# EAGLE design Mega (EAGLE 7.5.0)
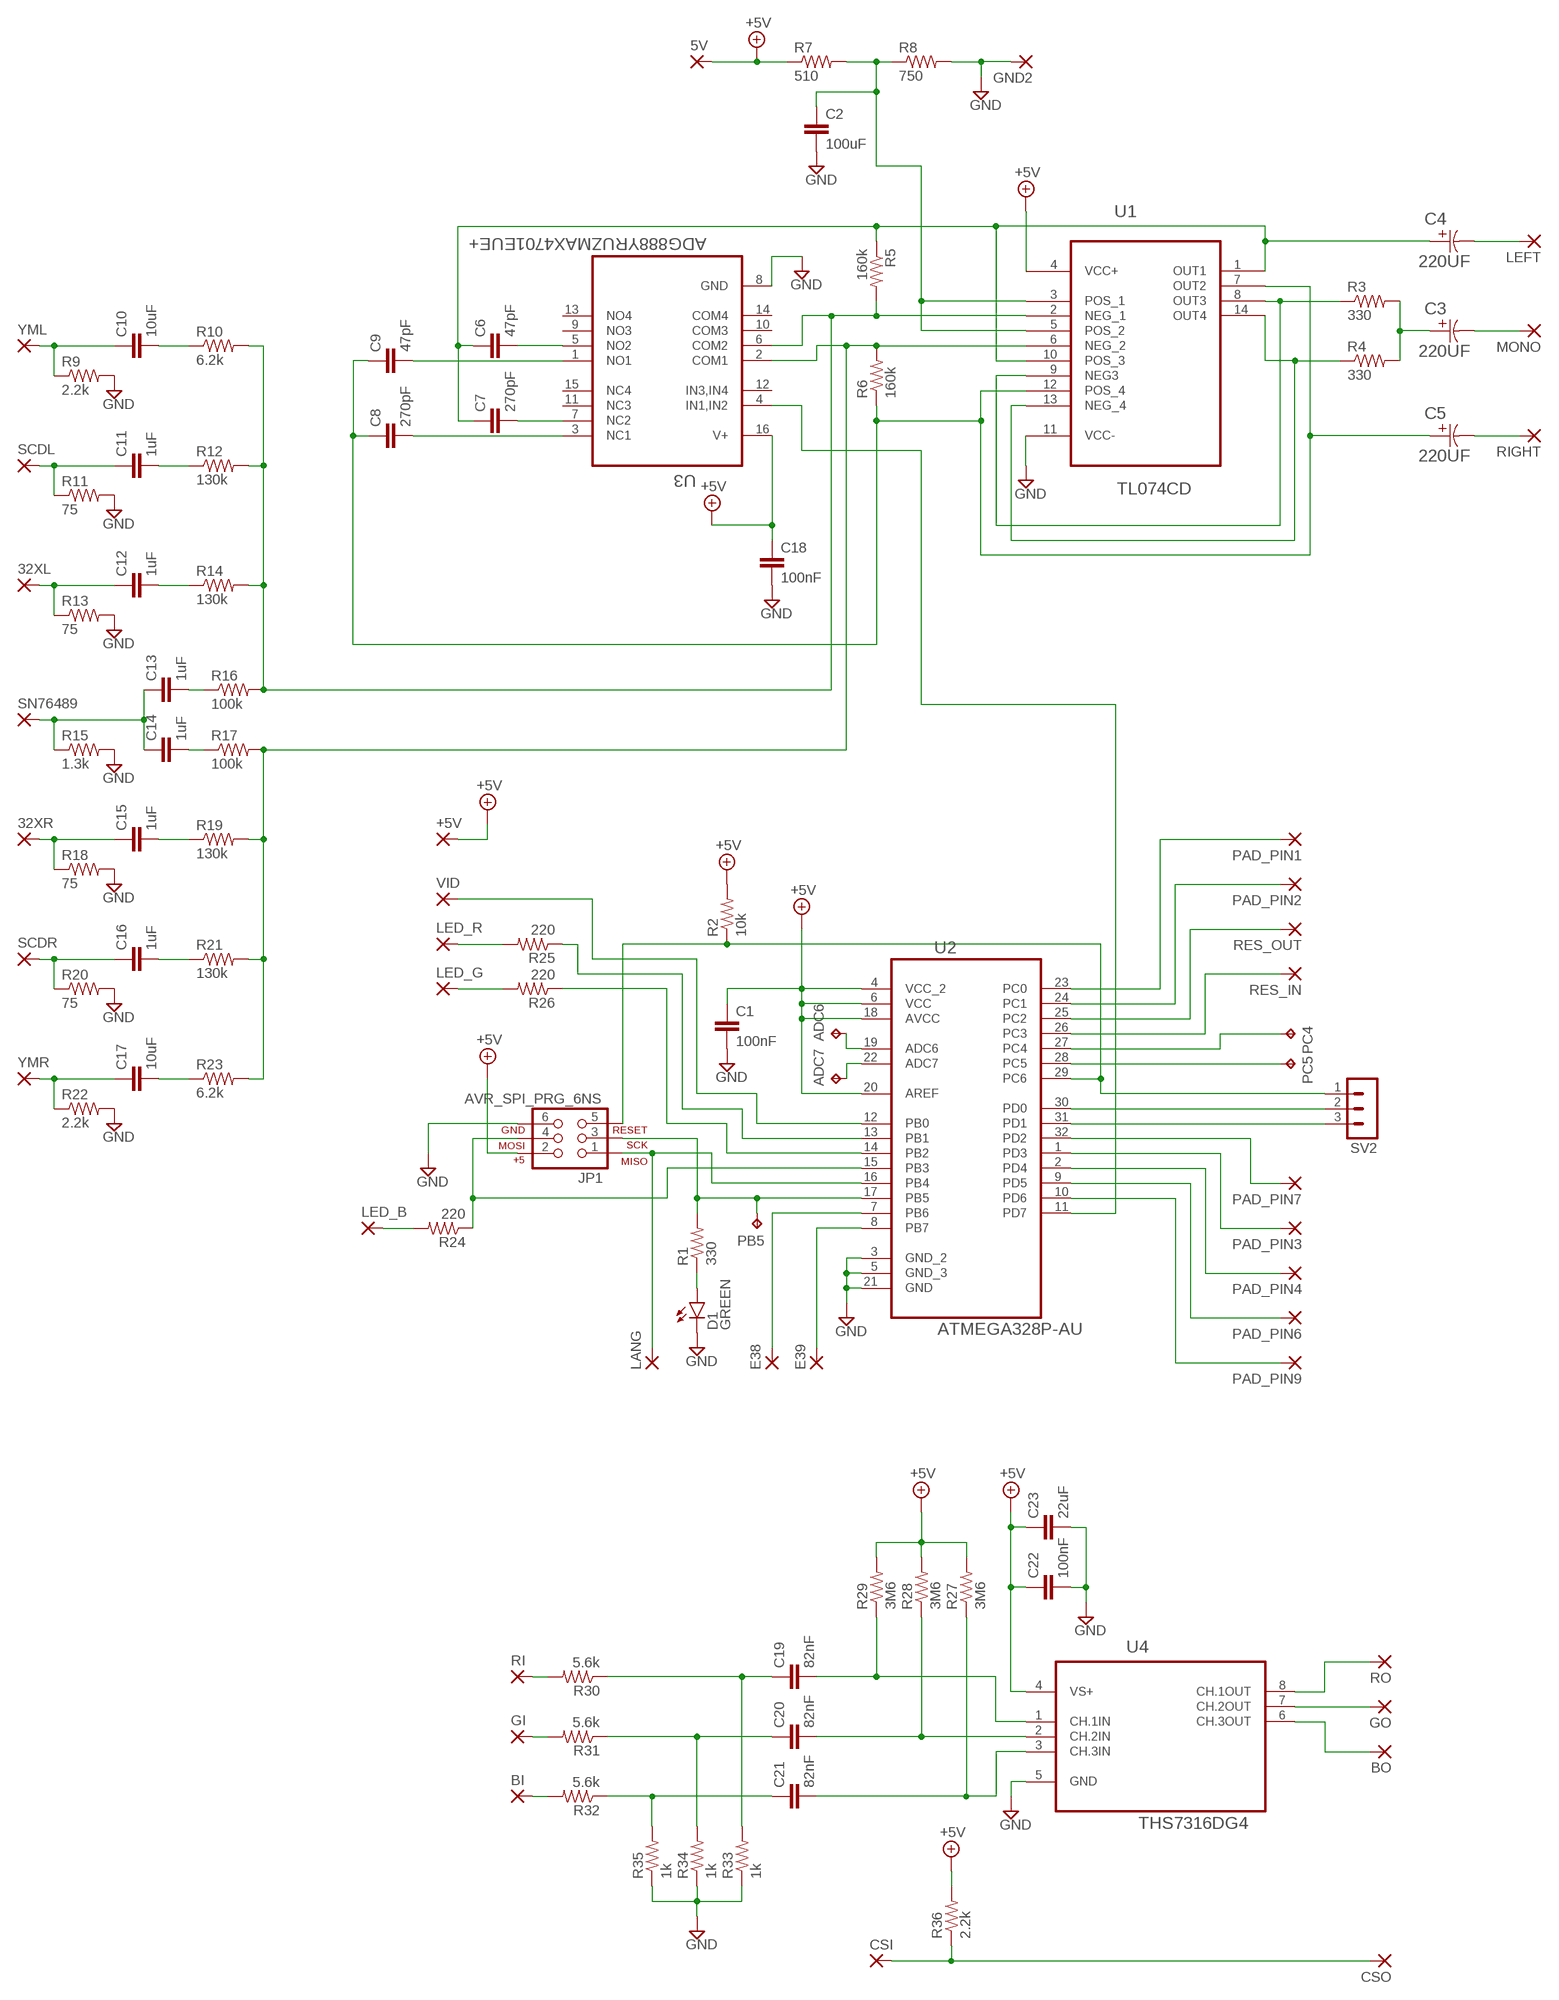
[diagram p0: schematic, sheet 1]

## Parts
5V  SMD2  [SMD1,27-2,54]
32XL  SMD2  [SMD1,27-2,54]
32XR  SMD2  [SMD1,27-2,54]
+5V  SMD2  [SMD1,27-2,54]
ADC6  TPB1,27  [B1,27]
ADC7  TPB1,27  [B1,27]
BI  SMD2  [SMD1,27-2,54]
BO  SMD2  [SMD1,27-2,54]
C1  100nF  CAP0805  [0805]
C2  100uF  CAP1206  [1206]
C3  220UF  EEE-FK1C221P-CASE-E  [CAPAE830X650N]
C4  220UF  EEE-FK1C221P-CASE-E  [CAPAE830X650N]
C5  220UF  EEE-FK1C221P-CASE-E  [CAPAE830X650N]
C6  47pF  CAP0805  [0805]
C7  270pF  CAP0805  [0805]
C8  270pF  CAP0805  [0805]
C9  47pF  CAP0805  [0805]
C10  10uF  CAP0805  [0805]
C11  1uF  CAP0805  [0805]
C12  1uF  CAP0805  [0805]
C13  1uF  CAP0805  [0805]
C14  1uF  CAP0805  [0805]
C15  1uF  CAP0805  [0805]
C16  1uF  CAP0805  [0805]
C17  10uF  CAP0805  [0805]
C18  100nF  CAP0805  [0805]
C19  82nF  CAP0805  [0805]
C20  82nF  CAP0805  [0805]
C21  82nF  CAP0805  [0805]
C22  100nF  CAP0805  [0805]
C23  22uF  CAP0805  [0805]
CSI  SMD2  [SMD1,27-2,54]
CSO  SMD2  [SMD1,27-2,54]
D1  GREEN  LED1206  [LED-1206]
E38  SMD2  [SMD1,27-2,54]
E39  SMD2  [SMD1,27-2,54]
GI  SMD2  [SMD1,27-2,54]
GND2  SMD2  [SMD1,27-2,54]
GO  SMD2  [SMD1,27-2,54]
JP1  AVR_SPI_PRG_6NS  [2X3-NS]
LANG  SMD2  [SMD1,27-2,54]
LED_B  SMD2  [SMD1,27-2,54]
LED_G  SMD2  [SMD1,27-2,54]
LED_R  SMD2  [SMD1,27-2,54]
LEFT  SMD2  [SMD1,27-2,54]
MONO  SMD2  [SMD1,27-2,54]
PAD_PIN1  SMD2  [SMD1,27-2,54]
PAD_PIN2  SMD2  [SMD1,27-2,54]
PAD_PIN3  SMD2  [SMD1,27-2,54]
PAD_PIN4  SMD2  [SMD1,27-2,54]
PAD_PIN6  SMD2  [SMD1,27-2,54]
PAD_PIN7  SMD2  [SMD1,27-2,54]
PAD_PIN9  SMD2  [SMD1,27-2,54]
PB5  TPB1,27  [B1,27]
PC4  TPB1,27  [B1,27]
PC5  TPB1,27  [B1,27]
R1  330  RESISTOR0805-RES  [0805]
R2  10k  RESISTOR0805-RES  [0805]
R3  330  RESISTOR0805-RES  [0805]
R4  330  RESISTOR0805-RES  [0805]
R5  160k  RESISTOR0805-RES  [0805]
R6  160k  RESISTOR0805-RES  [0805]
R7  510  RESISTOR0805-RES  [0805]
R8  750  RESISTOR0805-RES  [0805]
R9  2.2k  RESISTOR0805-RES  [0805]
R10  6.2k  RESISTOR0805-RES  [0805]
R11  75  RESISTOR0805-RES  [0805]
R12  130k  RESISTOR0805-RES  [0805]
R13  75  RESISTOR0805-RES  [0805]
R14  130k  RESISTOR0805-RES  [0805]
R15  1.3k  RESISTOR0805-RES  [0805]
R16  100k  RESISTOR0805-RES  [0805]
R17  100k  RESISTOR0805-RES  [0805]
R18  75  RESISTOR0805-RES  [0805]
R19  130k  RESISTOR0805-RES  [0805]
R20  75  RESISTOR0805-RES  [0805]
R21  130k  RESISTOR0805-RES  [0805]
R22  2.2k  RESISTOR0805-RES  [0805]
R23  6.2k  RESISTOR0805-RES  [0805]
R24  220  RESISTOR0805-RES  [0805]
R25  220  RESISTOR0805-RES  [0805]
R26  220  RESISTOR0805-RES  [0805]
R27  3M6  RESISTOR0805-RES  [0805]
R28  3M6  RESISTOR0805-RES  [0805]
R29  3M6  RESISTOR0805-RES  [0805]
R30  5.6k  RESISTOR0805-RES  [0805]
R31  5.6k  RESISTOR0805-RES  [0805]
R32  5.6k  RESISTOR0805-RES  [0805]
R33  1k  RESISTOR0805-RES  [0805]
R34  1k  RESISTOR0805-RES  [0805]
R35  1k  RESISTOR0805-RES  [0805]
R36  2.2k  RESISTOR0805-RES  [0805]
RES_IN  SMD2  [SMD1,27-2,54]
RES_OUT  SMD2  [SMD1,27-2,54]
RI  SMD2  [SMD1,27-2,54]
RIGHT  SMD2  [SMD1,27-2,54]
RO  SMD2  [SMD1,27-2,54]
SCDL  SMD2  [SMD1,27-2,54]
SCDR  SMD2  [SMD1,27-2,54]
SN76489  SMD2  [SMD1,27-2,54]
SV2  MA03-1  [MA03-1]
U1  TL074CD  [SOIC127P600X175-14N]
U2  ATMEGA328P-AU  [QFP80P900X900X120-32N]
U3  ADG888YRUZMAX4701EUE+  [SOP65P640X120-16N]
U4  THS7316DG4  [SOIC127P600X175-8N]
VID  SMD2  [SMD1,27-2,54]
YML  SMD2  [SMD1,27-2,54]
YMR  SMD2  [SMD1,27-2,54]

## Nets
+5V: 5V.1(P) +5V.1(P) C1.1 C18.1 C22.1 C23.1 JP1.2 R2.2 R7.1 R27.2 R28.2 R29.2 R36.2 U1.4(VCC+) U2.4(VCC_2) U2.6(VCC) U2.18(AVCC) U2.20(AREF) U3.16(V+) U4.4(VS+)
GND: C1.2 C2.2 C18.2 C22.2 C23.2 D1.C GND2.1(P) JP1.6 R8.2 R9.2 R11.2 R13.2 R15.2 R18.2 R20.2 R22.2 R33.1 R34.1 R35.1 U1.11(VCC-) U2.3(GND_2) U2.5(GND_3) U2.21(GND) U3.8(GND) U4.5(GND)
N$1: D1.A R1.1
N$2: JP1.3 PB5.TP R1.2 U2.17(PB5)
N$3: JP1.5 R2.1 SV2.1 U2.29(PC6)
N$4: JP1.1 LANG.1(P) U2.16(PB4)
N$5: JP1.4 R24.1 U2.15(PB3)
N$6: LED_R.1(P) R25.2
N$7: LED_G.1(P) R26.2
N$8: R3.1 U1.8(OUT3) U1.9(NEG3)
N$9: PC4.TP U2.27(PC4)
N$10: PC5.TP U2.28(PC5)
N$11: R4.1 U1.13(NEG_4) U1.14(OUT4)
N$12: C3.1 R3.2 R4.2
N$13: C3.2 MONO.1(P)
N$14: C4.2 LEFT.1(P)
N$15: RES_IN.1(P) U2.26(PC3)
N$16: C4.1 C6.1 C7.1 R5.1 U1.1(OUT1) U1.10(POS_3)
N$17: C5.1 C8.1 C9.1 R6.1 U1.7(OUT2) U1.12(POS_4)
N$18: C5.2 RIGHT.1(P)
N$19: R6.2 R17.2 R19.2 R21.2 R23.2 U1.6(NEG_2) U3.2(COM1)
N$20: C6.2 U3.5(NO2)
N$21: C8.2 U3.3(NC1)
N$22: C7.2 U3.7(NC2)
N$23: C9.2 U3.1(NO1)
N$24: C10.1 R9.1 YML.1(P)
N$25: C2.1 R7.2 R8.1 U1.3(POS_1) U1.5(POS_2)
N$26: C10.2 R10.1
N$27: C11.1 R11.1 SCDL.1(P)
N$28: C11.2 R12.1
N$29: 32XL.1(P) C12.1 R13.1
N$30: C12.2 R14.1
N$31: C13.1 C14.1 R15.1 SN76489.1(P)
N$32: C13.2 R16.1
N$33: C17.1 R22.1 YMR.1(P)
N$34: C14.2 R17.1
N$35: 32XR.1(P) C15.1 R18.1
N$36: C15.2 R19.1
N$37: C16.1 R20.1 SCDR.1(P)
N$38: C16.2 R21.1
N$39: C17.2 R23.1
N$40: R5.2 R10.2 R12.2 R14.2 R16.2 U1.2(NEG_1) U3.6(COM2)
N$41: PAD_PIN2.1(P) U2.24(PC1)
N$44: SV2.3 U2.31(PD1)
N$45: SV2.2 U2.30(PD0)
N$46: PAD_PIN7.1(P) U2.32(PD2)
N$47: PAD_PIN3.1(P) U2.1(PD3)
N$48: PAD_PIN4.1(P) U2.2(PD4)
N$49: PAD_PIN6.1(P) U2.9(PD5)
N$50: PAD_PIN9.1(P) U2.10(PD6)
N$51: LED_B.1(P) R24.2
N$52: R26.1 U2.14(PB2)
N$53: R25.1 U2.13(PB1)
N$56: U2.12(PB0) VID.1(P)
N$57: E38.1(P) U2.7(PB6)
N$58: E39.1(P) U2.8(PB7)
N$59: U2.11(PD7) U3.4(IN1,IN2)
N$60: C20.2 R28.1 U4.2(CH.2IN)
N$61: C19.2 R29.1 U4.1(CH.1IN)
N$62: C21.2 R27.1 U4.3(CH.3IN)
N$63: C19.1 R30.1 R33.2
N$64: C20.1 R31.1 R34.2
N$65: C21.1 R32.1 R35.2
N$66: BI.1(P) R32.2
N$67: GI.1(P) R31.2
N$68: R30.2 RI.1(P)
N$69: CSI.1(P) CSO.1(P) R36.1
N$70: GO.1(P) U4.7(CH.2OUT)
N$71: RO.1(P) U4.8(CH.1OUT)
N$72: BO.1(P) U4.6(CH.3OUT)
N$73: RES_OUT.1(P) U2.25(PC2)
N$74: PAD_PIN1.1(P) U2.23(PC0)
N$75: ADC7.TP U2.22(ADC7)
N$76: ADC6.TP U2.19(ADC6)
Unconnected: U3.9(NO3) U3.10(COM3) U3.11(NC3) U3.12(IN3,IN4) U3.13(NO4) U3.14(COM4) U3.15(NC4)

## Library data of the parts
5V 32XL 32XR +5V BI BO CSI CSO E38 E39 GI GND2 GO LANG LED_B LED_G LED_R LEFT MONO PAD_PIN1-PAD_PIN4 PAD_PIN6 PAD_PIN7 PAD_PIN9 RES_IN RES_OUT RI RIGHT RO SCDL SCDR SN76489 VID YML YMR = wirepad:SMD2: SMD PAD
ADC6 ADC7 PB5 PC4 PC5 = testpad:TP: Test pad
C1 C2 C6-C23 = SparkFun-Capacitors:CAP: Capacitor Standard 0603 ceramic capacitor, and 0.1" leaded capacitor.
C3-C5 = 220uF_2106:EEE-: Aluminum Electrolytic Capacitors,Surface Mount Type; MPN: EEE-FK1C221P; OC_FARNELL: 9695680; OC_NEWARK: 96K9382; PACKAGE: CASE-E; SUPPLIER: PANASONIC; TOLERANCE: 20 %; VOLTAGERATING: 16V
D1 = SparkFun-LED:LED: LEDs Standard schematic elements and footprints for 5mm, 3mm, 1206, and 0603 sized LEDs. 5mm - Spark Fun Electronics SKU : COM-00529 (and others)
JP1 = SparkFun-Connectors:AVR_SPI_PRG_6: AVR ISP 6 Pin This is the reduced ISP connector for AVR programming. Common on Arduino. This footprint will take up less PCB space and can be used with a 10-pin to 6-pin adapter such as SKU: BOB-08508 **Special note about "TEST_POINT" package. The stop mask is on the top side, so if you want your programming test points to be on the bottom of your board, make sure to place this package on the bottom side of the board. This also ensure that the orientation to program from the bottom side will be correct.
R1-R36 = SparkFun-Resistors:RESISTOR: Resistor Basic schematic elements and footprints for 0603, 1206, and PTH resistors.
SV2 = con-lstb:MA03-1: PIN HEADER; OC_FARNELL: unknown; OC_NEWARK: unknown
U1 = TL074_SMD:TL074CD: Low noise JFET quad operational amplifier; MPN: TL074CD; OC_FARNELL: 1651878; OC_NEWARK: 89K1719; PACKAGE: SOIC-14; SUPPLIER: STMICROELECTRONICS
U2 = Atmega328P:ATMEGA328P-AU: 8-bit Microcontroller with In-System Programmable Flash; MPN: ATMEGA328P-AU; OC_FARNELL: 1715486; OC_NEWARK: 14R4631; PACKAGE: TQFP-32; SUPPLIER: Atmel
U3 = MAX4701EUE+:ADG888YRUZ: 0.4 Ù CMOS, Dual DPDT Switch
U4 = THS7316:THS7316DG4: 3-Channel HDTV Video Amplifier; MPN: THS7316DG4; OC_FARNELL: 1390696; OC_NEWARK: 62M0371; PACKAGE: SOIC-8; SUPPLIER: TI

## Board
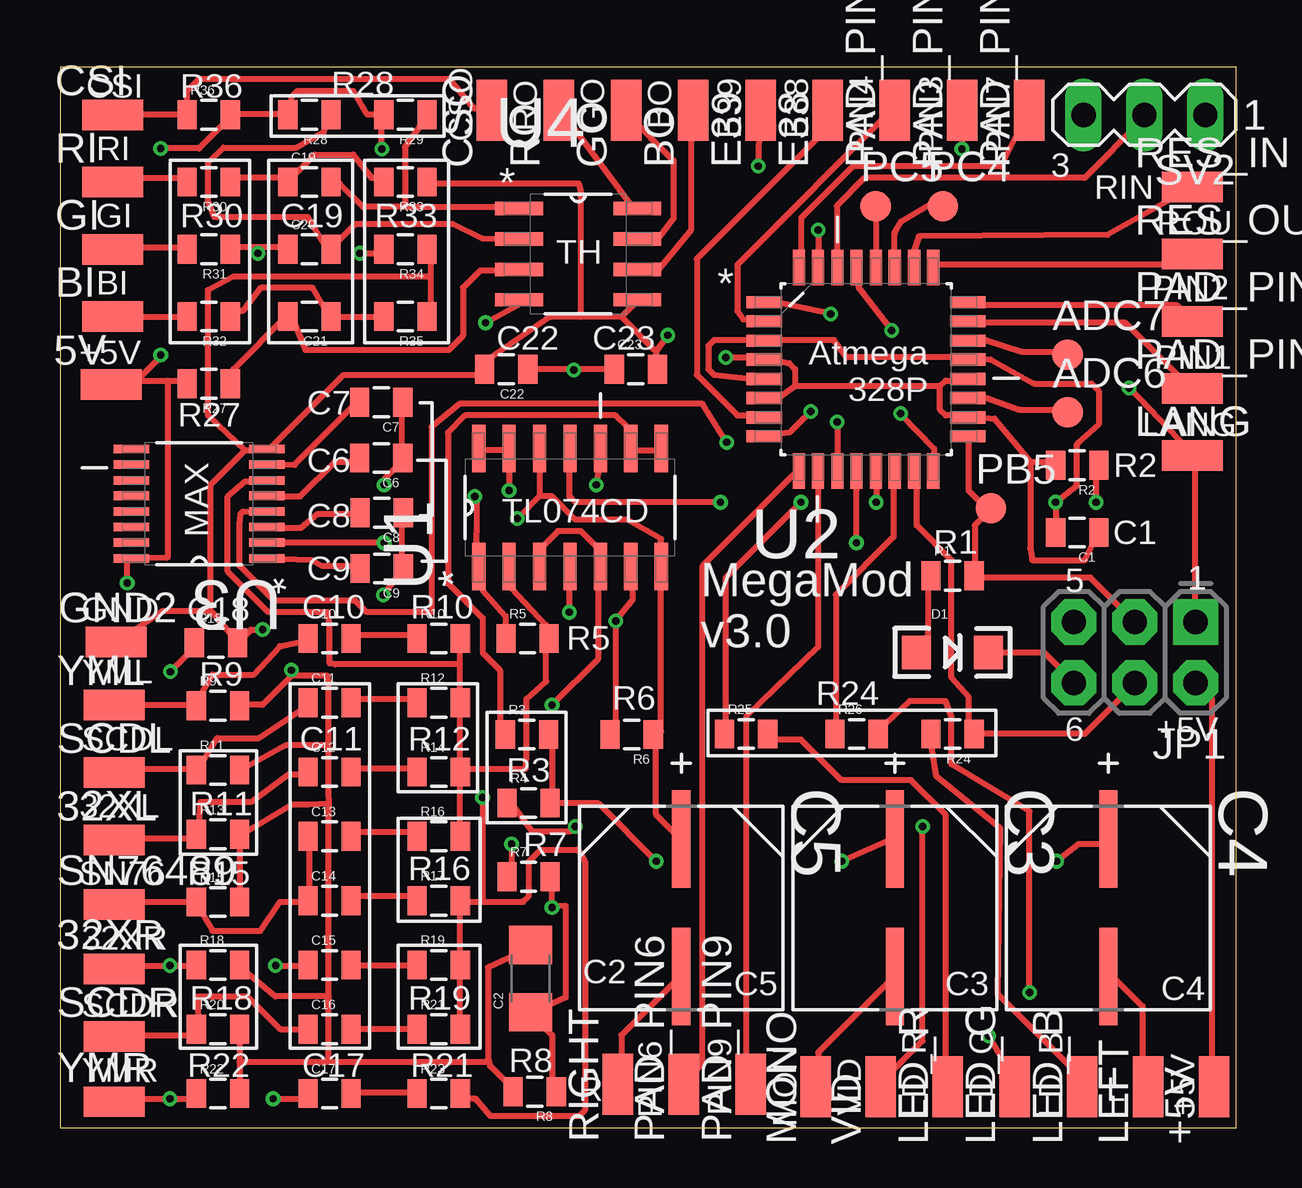
[diagram p1: board, top side]
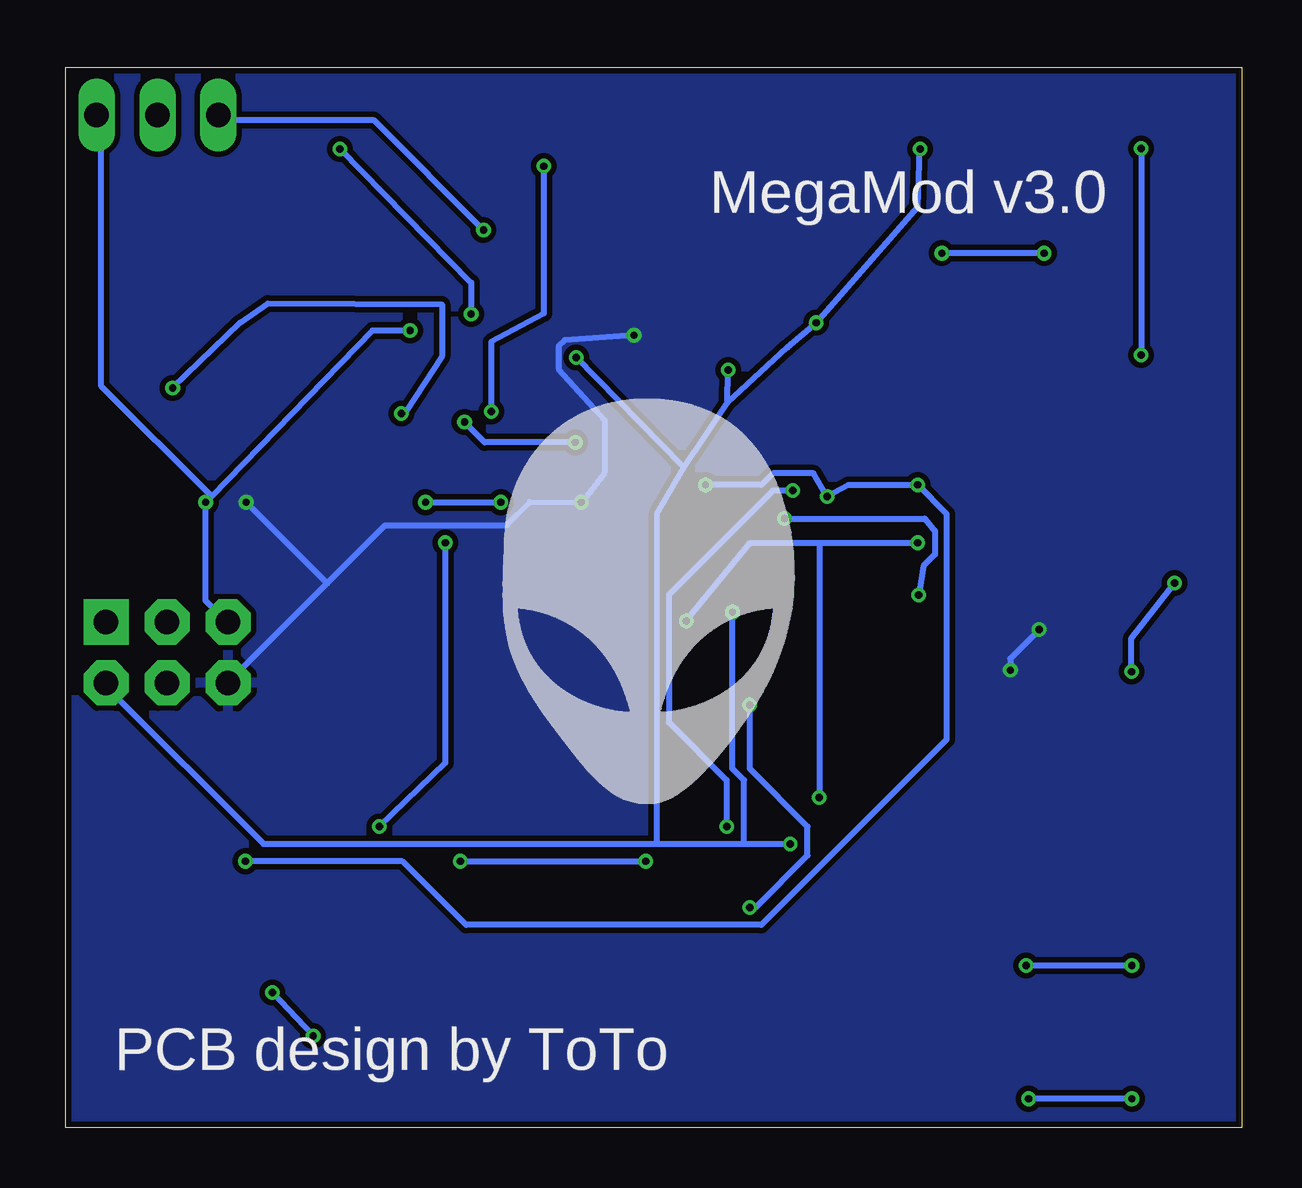
[diagram p2: board, bottom side, seen from below]

Size 49.03 x 44.19 mm. Coordinates in mm from the lower left corner, seen from the top.
Outline: 0,0 49.03,0 49.03,44.19 0,44.19 0,0
Copper layers (1*16): Top 0.035mm / dielectric 1.5mm / Bottom 0.035mm
Design rules "dirt_cheap_dirty_boards.v1 *": minimum track width 10mil, minimum drill 12mil, track to track 9mil, track to pad 9mil, pad to pad 9mil, via to via 10mil, smd to smd 0mil, copper to edge 10mil, drill to drill 10mil, minimum pad ring 10mil, minimum via ring 6mil, stop-mask expansion 2mil, vias tented up to drill 25mil, thermal gap 10mil

### Footprints (pad centres in the part's own frame; a part is rotated, then mirrored left to right if it is on the bottom)
SMD1,27-2,54 = smd 1.27 x 2.54: 1 0,0
B1,27 = smd 1.27 x 1.27: TP 0,0
0805 = smd 0.8 x 1.2: 1 -0.9,0; 2 0.9,0
1206 = smd 1.6 x 1.8: 1 -1.4,0; 2 1.4,0
CAPAE830X650N = smd 4.064 x 0.762: 1 -2.87,0; 2 2.87,0
LED-1206 = smd 1.2 x 1.4: A -1.5,0; C 1.5,0
2X3-NS = drill 1.016 pad 1.88 square: 1 -2.54,-1.27 | drill 1.016 pad 1.88 octagon: 2 -2.54,1.27; 3 0,-1.27; 4 0,1.27; 5 2.54,-1.27; 6 2.54,1.27
MA03-1 = drill 1.016 long: 1 -2.54,0; 2 0,0; 3 2.54,0
SOIC127P600X175-14N = smd 1.981 x 0.559: 1 -2.464,3.81; 2 -2.464,2.54; 3 -2.464,1.27; 4 -2.464,0; 5 -2.464,-1.27; 6 -2.464,-2.54; 7 -2.464,-3.81; 8 2.464,-3.81; 9 2.464,-2.54; 10 2.464,-1.27; 11 2.464,0; 12 2.464,1.27; 13 2.464,2.54; 14 2.464,3.81
QFP80P900X900X120-32N = smd 1.473 x 0.508: 1 -4.242,2.794; 2 -4.242,2.007; 3 -4.242,1.194; 4 -4.242,0.406; 5 -4.242,-0.406; 6 -4.242,-1.194; 7 -4.242,-2.007; 8 -4.242,-2.794; 17 4.242,-2.794; 18 4.242,-2.007; 19 4.242,-1.194; 20 4.242,-0.406; 21 4.242,0.406; 22 4.242,1.194; 23 4.242,2.007; 24 4.242,2.794 | smd 0.508 x 1.473: 9 -2.794,-4.242; 10 -2.007,-4.242; 11 -1.194,-4.242; 12 -0.406,-4.242; 13 0.406,-4.242; 14 1.194,-4.242; 15 2.007,-4.242; 16 2.794,-4.242; 25 2.794,4.242; 26 2.007,4.242; 27 1.194,4.242; 28 0.406,4.242; 29 -0.406,4.242; 30 -1.194,4.242; 31 -2.007,4.242; 32 -2.794,4.242
SOP65P640X120-16N = smd 1.473 x 0.356: 1 -2.819,2.286; 2 -2.819,1.626; 3 -2.819,0.965; 4 -2.819,0.33; 5 -2.819,-0.33; 6 -2.819,-0.965; 7 -2.819,-1.626; 8 -2.819,-2.286; 9 2.819,-2.286; 10 2.819,-1.626; 11 2.819,-0.965; 12 2.819,-0.33; 13 2.819,0.33; 14 2.819,0.965; 15 2.819,1.626; 16 2.819,2.286
SOIC127P600X175-8N = smd 1.981 x 0.559: 1 -2.464,1.905; 2 -2.464,0.635; 3 -2.464,-0.635; 4 -2.464,-1.905; 5 2.464,-1.905; 6 2.464,-0.635; 7 2.464,0.635; 8 2.464,1.905

### Placement (x,y rotation side)
5V  2.14,30.98 270 top
32XL  2.26,11.98 270 top
32XR  2.26,6.62 270 top
+5V  48.1,1.7 0 top
ADC6  42,29.8 0 top
ADC7  42,32.2 0 top
BI  2.2,33.8 270 top
BO  26.4,42.4 0 top
C1  42.4,24.8 180 top
C2  19.62,6.21 90 top
C3  34.8,9.16 270 top
C4  43.7,9.16 270 top
C5  25.9,9.16 270 top
C6  13.39,27.9 180 top
C7  13.39,30.22 180 top
C8  13.41,25.62 180 top
C9  13.41,23.3 180 top
C10  11.24,20.38 0 top
C11  11.24,17.7 0 top
C12  11.24,14.82 0 top
C13  11.24,12.14 0 top
C14  11.24,9.46 0 top
C15  11.24,6.78 0 top
C16  11.24,4.1 0 top
C17  11.24,1.42 0 top
C18  6.5,20.2 0 top
C19  10.4,39.4 0 top
C20  10.4,36.6 0 top
C21  10.4,33.8 180 top
C22  18.6,31.6 180 top
C23  24,31.6 0 top
CSI  2.2,42.2 270 top
CSO  18,42.4 0 top
D1  37.2,19.8 0 top
E38  32,42.4 0 top
E39  29.2,42.4 0 top
GI  2.2,36.6 270 top
GND2  2.34,20.24 270 top
GO  23.6,42.4 0 top
JP1  44.8,19.8 180 top
LANG  47.2,28 270 top
LED_B  42.6,1.7 0 top
LED_G  39.8,1.7 0 top
LED_R  37,1.7 0 top
LEFT  45.34,1.71 0 top
MONO  31.5,1.71 0 top
PAD_PIN1  47.2,30.8 270 top
PAD_PIN2  47.2,33.6 270 top
PAD_PIN3  37.6,42.4 0 top
PAD_PIN4  34.8,42.4 0 top
PAD_PIN6  26,1.8 0 top
PAD_PIN7  40.4,42.4 0 top
PAD_PIN9  28.8,1.8 0 top
PB5  38.8,25.8 0 top
PC4  36.8,38.4 0 top
PC5  34,38.4 0 top
R1  37.2,23 0 top
R2  42.4,27.6 180 top
R3  19.46,16.38 0 top
R4  19.53,13.53 0 top
R5  19.49,20.38 0 top
R6  23.83,16.38 180 top
R7  19.53,10.46 0 top
R8  19.79,1.5 180 top
R9  6.59,17.58 0 top
R10  15.79,20.38 0 top
R11  6.59,14.9 0 top
R12  15.79,17.7 0 top
R13  6.59,12.22 0 top
R14  15.79,14.82 0 top
R15  6.59,9.4 0 top
R16  15.79,12.14 0 top
R17  15.79,9.46 0 top
R18  6.59,6.78 0 top
R19  15.79,6.78 0 top
R20  6.59,4.1 0 top
R21  15.79,4.1 0 top
R22  6.59,1.42 0 top
R23  15.79,1.42 0 top
R24  37.2,16.4 180 top
R25  28.6,16.4 0 top
R26  33.2,16.4 0 top
R27  6.2,31 180 top
R28  10.4,42.2 180 top
R29  14.4,42.2 180 top
R30  6.2,39.4 180 top
R31  6.2,36.6 180 top
R32  6.2,33.8 180 top
R33  14.4,39.4 180 top
R34  14.4,36.6 180 top
R35  14.4,33.8 180 top
R36  6.2,42.2 0 top
RES_IN  47.2,39.2 270 top
RES_OUT  47.2,36.4 270 top
RI  2.2,39.4 270 top
RIGHT  23.25,1.8 0 top
RO  20.8,42.4 0 top
SCDL  2.26,14.8 270 top
SCDR  2.26,3.8 270 top
SN76489  2.26,9.3 270 top
SV2  45.2,42.2 180 top
U1  21.26,25.84 90 top
U2  33.6,31.6 0 top
U3  5.8,26 180 top
U4  21.6,36.4 0 top
VID  34.2,1.7 0 top
YML  2.26,17.62 270 top
YMR  2.26,1.08 270 top

### Tracks (layer width: path | path; a pad name or v marks a point on that pad's centre or on a via)
+5V  (via drill 0.3)
  Top 0.254: 3.2,31.13 2.17,31.13 5V.1 1.93,31.13 | 3.2,31.13 4.5,31.13 | 4.5,31.13 5.07,31.13 R27.2 | C18.1 5.55,20.03 5.55,19.95 v4.6,19 | 2.9,23.65 U3.16 | 4.5,31.13 4.5,23.79 4.46,23.75 4.44,23.75 U3.16 | 30.64,30.89 29.96,30.4 29.44,30.4 U2.6 | 30.64,30.89 30.64,31.61 30.4,31.85 29.44,32.05 U2.4 29.2,32.09 v27.75,32.09 | 40.44,27.75 41.26,27.75 R2.2 | 40.44,27.75 38.95,29.54 37.88,29.64 U2.18 37.64,29.68 36.92,29.68 36.68,29.92 36.68,30.89 | 40.44,27.75 40.44,24.13 40.52,23.65 42.73,23.65 43.19,24.61 C1.1 | 36.68,30.89 36.92,31.13 37.64,31.13 U2.20 | 36.68,30.89 30.64,30.89 | 21.51,31.61 22.92,31.61 C23.1 | 21.51,31.61 19.55,31.61 C22.1 | v18.82,11.82 18.82,10.62 R7.1 | v17.74,33.54 19.06,34.27 U4.4 | v21.23,21.48 21.23,23.16 U1.4 | v21.41,31.57 21.51,31.61 | +5V.1 48.02,1.93 48.02,17.86 47.54,18.34 JP1.2 | v13.41,40.78 13.41,41.99 R29.2 13.27,42.23 12.79,42.23 12.22,43.19 12.22,43.2 9.9,43.2 9.65,42.95 9.65,42.23 R28.2 9.41,42.23 7.24,42.23 R36.2 7,41.99 5.81,40.8 v4.2,40.8 | v4.2,32.2 4.2,32.13 3.2,31.13 | v2.8,22.7 2.8,23.53 U3.16
  Bottom 0.254: 24.37,11.82 40.78,11.82 47.3,18.34 JP1.2 | 24.37,11.82 20.75,11.82 | 20.75,11.82 v18.82,11.82 | 23.28,27.47 24.37,25.58 24.37,11.82 | 23.28,27.47 21.45,30.2 | 21.45,30.2 18.94,32.51 v17.74,33.54 13.51,38.37 v13.41,40.78 | v21.23,21.48 21.23,14.96 20.75,14.48 20.75,11.82 | 21.45,30.2 v21.41,31.57 | v27.75,32.09 23.32,27.57 23.28,27.47 | v4.2,40.8 v4.2,32.2 | v4.6,19 4.6,20.4 v2.8,22.7
GND  (via drill 0.3)
  Top 0.254: U2.5 29.2,31.17 27.27,31.37 27.03,31.61 27.03,32.58 27.27,32.82 29.2,32.82 U2.3 29.44,32.82 32.27,32.82 32.79,32.09 37.64,32.09 U2.21 37.88,32.05 38.45,32.05 38.8,32 40.6,31 43,31 43.3,30.7 43.3,29.3 42.41,28.52 42.37,28.41 42.37,26.73 v41.5,26.06 41.5,24.85 C1.2 | D1.C 38.85,19.79 41.02,19.79 42.23,18.58 JP1.6 | v27.53,26.06 21.48,26.06 21.23,26.3 21.23,28.23 U1.11 | R15.2 7.48,12.06 R13.2 7.72,12.31 9.69,13.47 10.38,13.47 11.22,13.51 | 11.2,15.68 11.16,15.93 9.41,15.93 7.65,14.96 7.72,14.96 R11.2 | 11.2,15.68 11.2,13.99 11.22,13.51 | 9.65,18.82 8.45,17.61 7.72,17.61 R9.2 | 9.65,18.82 11.16,18.82 11.2,18.58 11.2,15.68 | 17.84,2.86 17.92,2.58 18.82,1.69 R8.2 | 17.84,2.86 17.84,6.67 19.55,7.48 C2.2 | 7.48,2.74 7.48,3.86 R20.2 | 7.48,2.74 7.48,1.45 R22.2 | 11.2,5.47 8.97,5.47 7.72,6.51 7.72,6.76 R18.2 | 11.2,2.74 11.2,5.47 | 7.48,2.74 11.2,2.74 | 17.84,2.86 17.82,2.74 11.2,2.74 | 11.22,13.51 11.2,13.03 11.2,5.47 | 23.41,33.78 21.71,33.78 | 21.71,33.78 20.43,33.78 17.86,32.01 C22.2 17.61,31.37 11.82,31.37 8.69,28.23 U3.8 8.45,28.23 7.72,28.23 | 23.41,33.78 23.89,34.27 U4.5 | 24.85,32.33 24.85,31.61 C23.2 | 23.41,33.78 24.85,32.33 | 21.71,33.78 21.71,39.05 21.63,39.33 15.44,39.33 R33.1 | 15.44,35.47 15.44,36.44 R34.1 | 15.44,35.47 15.44,34.02 R35.1 | 6.27,21.53 6.44,21.37 C18.2 7.48,20.27 7.96,20.75 v8.45,20.75 | 6.27,21.53 4.28,21.53 2.41,20.27 GND2.1 | 7.72,28.23 6.27,26.78 6.27,21.53 | 15.44,35.47 7.24,35.47 6.17,34.91 6.17,29.68 7.72,28.23 | v9.65,19.06 9.65,18.82 | 24.85,32.33 v25.34,33.02
  Bottom 0.254: 38.12,22.68 42.23,18.58 JP1.6 | 38.12,22.68 35.71,25.09 30.64,25.09 29.68,26.06 v27.53,26.06 27.53,26.01 26.57,27.27 26.57,29.5 28.47,31.61 28.47,32.58 28.23,32.82 v25.34,33.02 | 38.12,22.68 v41.5,26.06 | v9.65,19.06 9.65,19.55 v8.45,20.75
  pour Bottom: -0.4,-0.4 -0.7,44.7 49.7,44.9 49.6,-0.6
N$1
  Top 0.254: R1.1 36.2,22.92 36.2,20.51 35.71,20.03 D1.A
N$2
  Top 0.254: U2.17 37.88,28.71 37.88,26.54 38.61,25.82 PB5.TP 38.61,25.58 38.12,25.09 38.12,23.16 R1.2 38.12,22.92 42.95,22.92 44.64,21.23 JP1.3
N$3  (via drill 0.3)
  Top 0.254: v43.19,26.06 43.19,27.51 R2.1 | v34.67,33.22 33.3,34.99 33.3,35.71 U2.29
  Bottom 0.254: JP1.5 42.47,21.23 43.19,21.96 v43.19,26.06 42.95,26.3 | v34.67,33.22 36.24,33.22 42.95,26.3 | 42.95,26.3 47.54,30.89 47.54,41.99 SV2.1
N$4  (via drill 0.3)
  Top 0.254: v35.04,29.76 36.44,28.31 U2.16 | v44.56,30.82 47.05,28.23 LANG.1 47.3,27.99 47.3,21.23 JP1.1
  Bottom 0.254: v35.04,29.76 34.84,29.84 33.35,32.13 33.35,34.3 40.59,34.34 41.74,33.54 v44.56,30.82
N$5
  Top 0.254: JP1.4 44.64,18.34 42.71,16.41 38.12,16.41 R24.1 37.88,16.41 37.88,17.93 37.16,18.76 37.16,23.65 35.71,25.09 35.71,27.27 U2.15
N$6
  Top 0.254: R25.2 29.68,16.17 30.89,16.17 32.58,14.48 35.47,14.48 36.92,13.03 36.92,1.93 LED_R.1
N$7  (via drill 0.3)
  Top 0.254: v40.41,5.63 40.41,13.18 37.16,15.14 37.16,17.13 36.92,17.77 35.41,17.77 34.15,16.61 34.27,16.41 R26.2 | v38.72,3.82 39.81,1.93 LED_G.1
  Bottom 0.254: v38.72,3.82 v40.41,5.63
N$8
  Top 0.254: R3.1 18.34,16.41 18.34,19.06 17.61,19.79 17.61,21.23 16.17,22.68 16.17,28.96 16.89,29.68 23.16,29.68 23.65,29.2 23.65,28.47 U1.9 23.89,28.23 24.85,28.23 U1.8
N$9
  Top 0.254: PC4.TP 36.58,38.67 35.07,37.76 34.83,37.36 34.79,37.22 34.79,35.95 U2.27
N$10
  Top 0.254: PC5.TP 34.02,38.37 34.02,35.95 U2.28
N$11  (via drill 0.3)
  Top 0.254: v18.72,26.54 18.72,28.23 U1.13 18.58,28.23 17.61,28.23 U1.14 | R4.1 18.82,13.51 19.69,12.35 21.28,12.35 v21.48,12.55
  Bottom 0.254: v21.48,12.55 21.48,14.48 23.89,16.89 23.89,22.2 19.55,26.54 v18.72,26.54
N$12  (via drill 0.3)
  Top 0.254: R3.2 20.51,16.17 20.51,13.75 R4.2 20.51,13.51 22.44,13.51 v24.85,11.1 | v32.58,11.1 34.75,12.06 C3.1
  Bottom 0.254: v32.58,11.1 v24.85,11.1
N$13
  Top 0.254: MONO.1 31.61,1.93 31.61,3.14 34.75,6.27 C3.2
N$14
  Top 0.254: LEFT.1 45.12,1.93 45.12,5.07 43.92,6.27 C4.2
N$15
  Top 0.254: U2.26 35.61,35.85 35.61,36.58 35.8,37.14 43.66,37.2 47.05,39.09 RES_IN.1
N$16  (via drill 0.3)
  Top 0.254: C7.1 14.24,30.16 14.24,27.99 C6.1 14.24,27.75 13.51,27.03 v13.51,26.78 | R5.1 18.58,20.51 18.58,21.32 17.61,22.38 17.61,23.16 U1.1 17.37,23.41 17.39,26.19 v17.29,26.3 | v22.36,26.78 22.44,27.27 22.44,28.23 U1.10 | v41.54,11.1 42.46,11.82 43.67,11.82 C4.1
  Bottom 0.254: v22.36,26.78 20.03,26.78 19.55,27.27 17.86,27.27 v17.29,26.3 16.41,26.78 v13.51,26.78 12.31,25.58 12.31,16.17 20.03,8.45 32.33,8.45 34.99,11.1 v41.54,11.1
N$17  (via drill 0.3)
  Top 0.254: C8.1 14.24,25.58 14.24,23.41 C9.1 14.24,23.16 v13.47,22.2 | 19.99,26.3 v19.06,25.38 | 19.99,26.3 19.99,28.23 U1.12 | C5.1 25.82,12.06 24.85,13.03 24.85,16.17 R6.1 25.05,16.51 25.05,23.16 U1.7 25.05,23.41 25.05,24.53 23.65,25.34 21.48,25.34 20.51,26.3 19.99,26.3
  Bottom 0.254: v13.47,22.2 13.27,23.41 12.79,23.89 12.79,24.85 13.21,25.38 v19.06,25.38
N$18
  Top 0.254: RIGHT.1 23.41,1.93 23.41,3.86 25.82,6.27 C5.2
N$19  (via drill 0.3)
  Top 0.254: R21.2 16.65,4.1 16.65,6.76 R19.2 16.65,7 16.65,9.41 R17.2 16.89,9.41 17.61,9.41 | 17.61,9.41 19.3,9.41 19.55,9.65 19.55,11.1 20.03,11.58 21.59,11.58 21.88,11.1 21.88,0.72 21.63,0.48 17.94,0.48 17.32,1.21 16.89,1.21 R23.2 | R6.2 23.16,16.41 v23.16,21.12 23.86,22 23.85,22.68 23.85,23.27 U1.6 | v13.51,24.37 8.69,24.37 U3.2 | v17.61,13.75 17.61,9.41
  Bottom 0.254: 17.61,24.37 20.51,24.37 v23.16,21.12 | 17.61,24.37 v13.51,24.37 | 17.61,24.37 v17.61,13.75
N$20
  Top 0.254: C6.2 12.31,27.75 11.46,27.75 10.01,26.3 8.69,26.3 U3.5
N$21
  Top 0.254: C8.2 12.31,25.58 10.73,25.58 10.05,25 8.69,25 U3.3
N$22
  Top 0.254: C7.2 12.31,30.16 9.85,27.71 9.79,27.61 U3.7
N$23
  Top 0.254: C9.2 12.31,23.41 10.93,23.41 10.49,23.65 U3.1
N$24
  Top 0.254: YML.1 2.41,17.61 5.55,17.61 R9.1 5.62,17.61 6.36,18.88 8.08,18.88 9.17,20.07 10.13,20.27 C10.1
N$25  (via drill 0.3)
  Top 0.254: U1.3 20.03,23.41 20.03,24.13 20.75,24.85 21.72,24.85 22.44,24.13 22.44,23.41 U1.5 22.44,23.16 22.44,19.55 v20.51,17.61 | R8.1 20.51,1.69 20.51,3.86 19.79,4.58 C2.1 19.79,4.83 21.09,5.43 21.09,9.24 20.51,9.23 | v20.51,9.17 20.51,9.23 | 20.51,9.23 20.51,10.38 R7.2
  Bottom 0.254: v20.51,17.61 20.51,14.96 18.1,12.55 18.1,11.34 20.27,9.17 v20.51,9.17
N$26
  Top 0.254: C10.2 12.31,20.51 14.72,20.51 R10.1
N$27
  Top 0.254: SCDL.1 2.41,14.96 5.55,14.96 R11.1 5.79,14.96 6.56,16.23 8.28,16.23 10.37,17.61 10.13,17.61 C11.1
N$28
  Top 0.254: C11.2 12.31,17.86 14.72,17.86 R12.1
N$29
  Top 0.254: 32XL.1 2.41,12.06 5.55,12.06 R13.1 5.79,12.31 5.86,13.57 7.98,13.57 9.53,14.72 10.13,14.72 C12.1
N$30
  Top 0.254: C12.2 12.31,14.96 14.72,14.96 R14.1
N$31
  Top 0.254: C13.1 10.38,12.06 10.38,9.65 C14.1 10.13,9.41 9.17,9.41 8.36,8.2 6.36,8.2 5.79,9.17 R15.1 5.55,9.41 2.41,9.41 SN76489.1
N$32
  Top 0.254: C13.2 12.31,12.31 14.72,12.31 R16.1
N$33  (via drill 0.3)
  Top 0.254: R22.1 5.55,1.21 v4.58,1.21 2.41,1.21 YMR.1 | v8.89,1.21 10.13,1.21 C17.1
  Bottom 0.254: v4.58,1.21 v8.89,1.21
N$34
  Top 0.254: C14.2 12.31,9.65 14.72,9.65 R17.1
N$35  (via drill 0.3)
  Top 0.254: R18.1 5.55,6.76 v4.58,6.76 2.41,6.76 32XR.1 | v8.99,6.76 10.13,6.76 C15.1
  Bottom 0.254: v4.58,6.76 v8.99,6.76
N$36
  Top 0.254: C15.2 12.31,6.76 14.72,6.76 R19.1
N$37
  Top 0.254: SCDR.1 2.41,3.86 5.55,3.86 R20.1 5.79,4.1 5.76,5.47 7.8,5.47 9.17,4.1 10.13,4.1 C16.1
N$38
  Top 0.254: C16.2 12.31,4.1 14.72,4.1 R21.1
N$39
  Top 0.254: C17.2 12.31,1.45 14.72,1.45 R23.1
N$40
  Top 0.254: U1.2 18.82,23.16 18.82,22.48 20.27,20.93 20.27,20.51 R5.2 20.27,20.27 20.27,18.58 19.45,17.86 19.45,15.68 19.42,14.96 16.89,14.96 R14.2 | R16.2 16.65,12.31 16.65,14.72 R14.2 | 16.65,19.3 16.65,20.27 R10.2 | 16.65,19.3 16.65,17.86 R12.2 16.65,17.61 16.65,14.96 R14.2 | 16.65,19.3 11.48,19.3 11.24,19.34 11.24,20.99 11.16,21.48 8.69,21.48 7,23.16 7,26.3 7.72,26.93 8.35,26.93 U3.6
N$41
  Top 0.254: U2.24 37.88,34.27 46.57,34.27 47.05,33.78 PAD_PIN2.1
N$44  (via drill 0.3)
  Top 0.254: v31.61,37.4 31.61,35.95 U2.31
  Bottom 0.254: v31.61,37.4 36.2,41.99 42.47,41.99 SV2.3
N$45
  Top 0.254: U2.30 32.38,35.95 32.38,38.41 33.54,39.57 42.71,39.57 45.12,41.99 SV2.2
N$46
  Top 0.254: U2.32 30.89,35.95 30.89,37.88 33.06,40.06 39.23,40.06 40.3,42.23 PAD_PIN7.1
N$47  (via drill 0.3)
  Top 0.254: v32.13,33.91 29.74,34.41 U2.1 | v37.59,40.78 37.64,42.23 PAD_PIN3.1
  Bottom 0.254: v32.13,33.91 32.13,35.21 v37.59,40.78
N$48
  Top 0.254: U2.2 29.2,33.68 28.47,33.68 28.23,34.02 28.23,35.95 34.75,42.47 PAD_PIN4.1
N$49
  Top 0.254: U2.9 30.64,27.27 26.78,23.41 26.78,2.65 26.06,1.93 PAD_PIN6.1
N$50
  Top 0.254: U2.10 31.61,27.27 31.61,20.03 28.61,17.13 28.61,1.53 PAD_PIN9.1
N$51
  Top 0.254: R24.2 36.24,16.47 36.54,14.64 39.19,12.48 39.09,5.55 42.71,1.93 LED_B.1
N$52
  Top 0.254: R26.1 32.33,16.41 32.33,22.2 34.75,24.61 34.75,27.27 U2.14
N$53  (via drill 0.3)
  Top 0.254: v30.89,26.06 27.75,22.92 27.75,16.41 R25.1 | v34.02,26.06 34.02,27.27 U2.13
  Bottom 0.254: v34.02,26.06 v30.89,26.06
N$56  (via drill 0.3)
  Top 0.254: v33.2,24.37 33.2,26.57 U2.12 | v35.95,12.55 35.95,3.62 34.27,1.93 VID.1
  Bottom 0.254: v33.2,24.37 33.2,15.2 v35.95,12.55
N$57
  Top 0.254: U2.7 29.2,29.68 28.23,29.68 26.54,31.37 26.54,36.2 31.85,41.5 31.85,42.23 E38.1
N$58  (via drill 0.3)
  Top 0.254: v31.29,29.84 30.4,28.96 29.44,28.86 U2.8 | v29.1,40.06 29.14,41.33 E39.1
  Bottom 0.254: v31.29,29.84 31.29,32.74 29.1,33.92 v29.1,40.06
N$59  (via drill 0.3)
  Top 0.254: v27.79,28.56 26.78,30.16 16.65,30.16 15.48,29.2 15.48,23.27 15.49,21.48 12.79,21.48 12.31,21.96 8.93,21.96 7.48,23.41 7.48,25.14 7.52,25.58 7.65,25.68 U3.4 | v32.4,29.4 U2.11
  Bottom 0.254: v27.79,28.56 31.56,28.56 v32.4,29.4
N$60
  Top 0.254: U4.2 17.56,37.06 16.38,37.64 12.31,37.64 11.34,36.68 C20.2 11.1,36.68 10.34,37.94 6.44,37.94 6.17,38.61 6.17,40.2 6.82,40.84 9.85,40.84 11,41.49 R28.1
N$61
  Top 0.254: 14.39,38.37 12.63,38.37 11.66,39.33 11.34,39.33 C19.2 | 14.39,38.37 14.38,38.85 14.38,40.86 15.2,41.99 R29.1 | 14.39,38.37 19.06,38.37 U4.1
N$62
  Top 0.254: R27.1 7.24,31.13 7.24,31.61 9.41,33.78 C21.2 9.65,33.78 10.23,32.4 16.2,32.4 16.8,33 16.8,35 17.51,35.71 19.06,35.71 U4.3
N$63
  Top 0.254: R30.1 7.24,39.57 9.41,39.57 C19.1 9.65,39.57 10.62,40.54 12.22,40.54 12.99,39.57 13.27,39.57 R33.2
N$64  (via drill 0.3)
  Top 0.254: 8.45,36.68 9.41,36.68 C20.1 | 8.45,36.68 7.24,36.68 R31.1 | v12.51,36.44 13.27,36.44 R34.2 | 8.45,36.68 v8.24,36.44
  Bottom 0.254: v8.24,36.44 v12.51,36.44
N$65
  Top 0.254: R32.1 7.24,34.02 7.6,34.02 8.37,34.99 10.54,34.99 11.1,34.02 C21.1 11.34,33.78 13.27,33.78 R35.2
N$66
  Top 0.254: R32.2 5.07,33.78 2.41,33.78 BI.1
N$67
  Top 0.254: R31.2 5.07,36.68 2.41,36.68 GI.1
N$68
  Top 0.254: R30.2 5.07,39.57 2.41,39.57 RI.1
N$69
  Top 0.254: CSI.1 2.41,42.23 5.07,42.23 R36.1 5.31,42.13 5.31,43.21 5.8,43.7 16.22,43.7 16.24,43.67 17.25,42.47 17.86,42.47 CSO.1
N$70
  Top 0.254: U4.7 24.13,37.16 24.95,37.06 25.58,37.88 25.58,40.3 23.65,42.23 GO.1
N$71
  Top 0.254: U4.8 23.89,38.37 23.89,38.33 20.99,42.23 RO.1
N$72
  Top 0.254: U4.6 24.13,35.75 24.95,35.75 26.3,37.4 26.3,42.23 BO.1
N$73
  Top 0.254: U2.25 36.44,35.95 46.81,35.95 47.05,36.2 RES_OUT.1
N$74
  Top 0.254: U2.23 37.88,33.54 44.4,33.54 47.05,30.89 PAD_PIN1.1
N$75
  Top 0.254: ADC7.TP 41.99,32.33 40.09,32.33 38.61,32.82 37.88,32.82 U2.22
N$76
  Top 0.254: ADC6.TP 41.99,29.92 39.99,29.92 38.61,30.4 37.88,30.4 U2.19

### Text on the board
tPlace: CSI | R36 | R28 | RO | GO | BO | CSO | E39 | E38 | PIN4 | PIN3 | PIN7 | RI | 3 | RIN | GI | R30 | C19 | R33 | TH | ROU | BI | PIN2 | Atmega / 328P | +5V | C22 | C23 | PIN1 | C7 | R27 | LANG | C6 | R2 | MAX | C8 | TL074CD | R1 | C1 | C9 | 5 | 1 | GND | C18 | C10 | R10 | R5 | MegaMod / v3.0 | YML | R9 | R24 | R6 | SCDL | C11 | R12 | 6 | +5V | R3 | 32XL | R11 | R7 | SN76 | R15 | R16 | 32XR | C2 | C5 | C3 | SCDR | R18 | R19 | C4 | MON | YMR | R22 | C17 | R21 | R8 | R | L | PIN6 | PIN9 | VID | LD_R | LD_G | LD_B | +5V
bPlace: MegaMod v3.0 | PCB design by ToTo | C:/Users/Antonio/Desktop/alien-head-stencle.bmp | C:/Users/Antonio/Desktop/alien-head-stencle.bmp